# EAGLE schematic Torque_Coils (EAGLE 9.6.2)
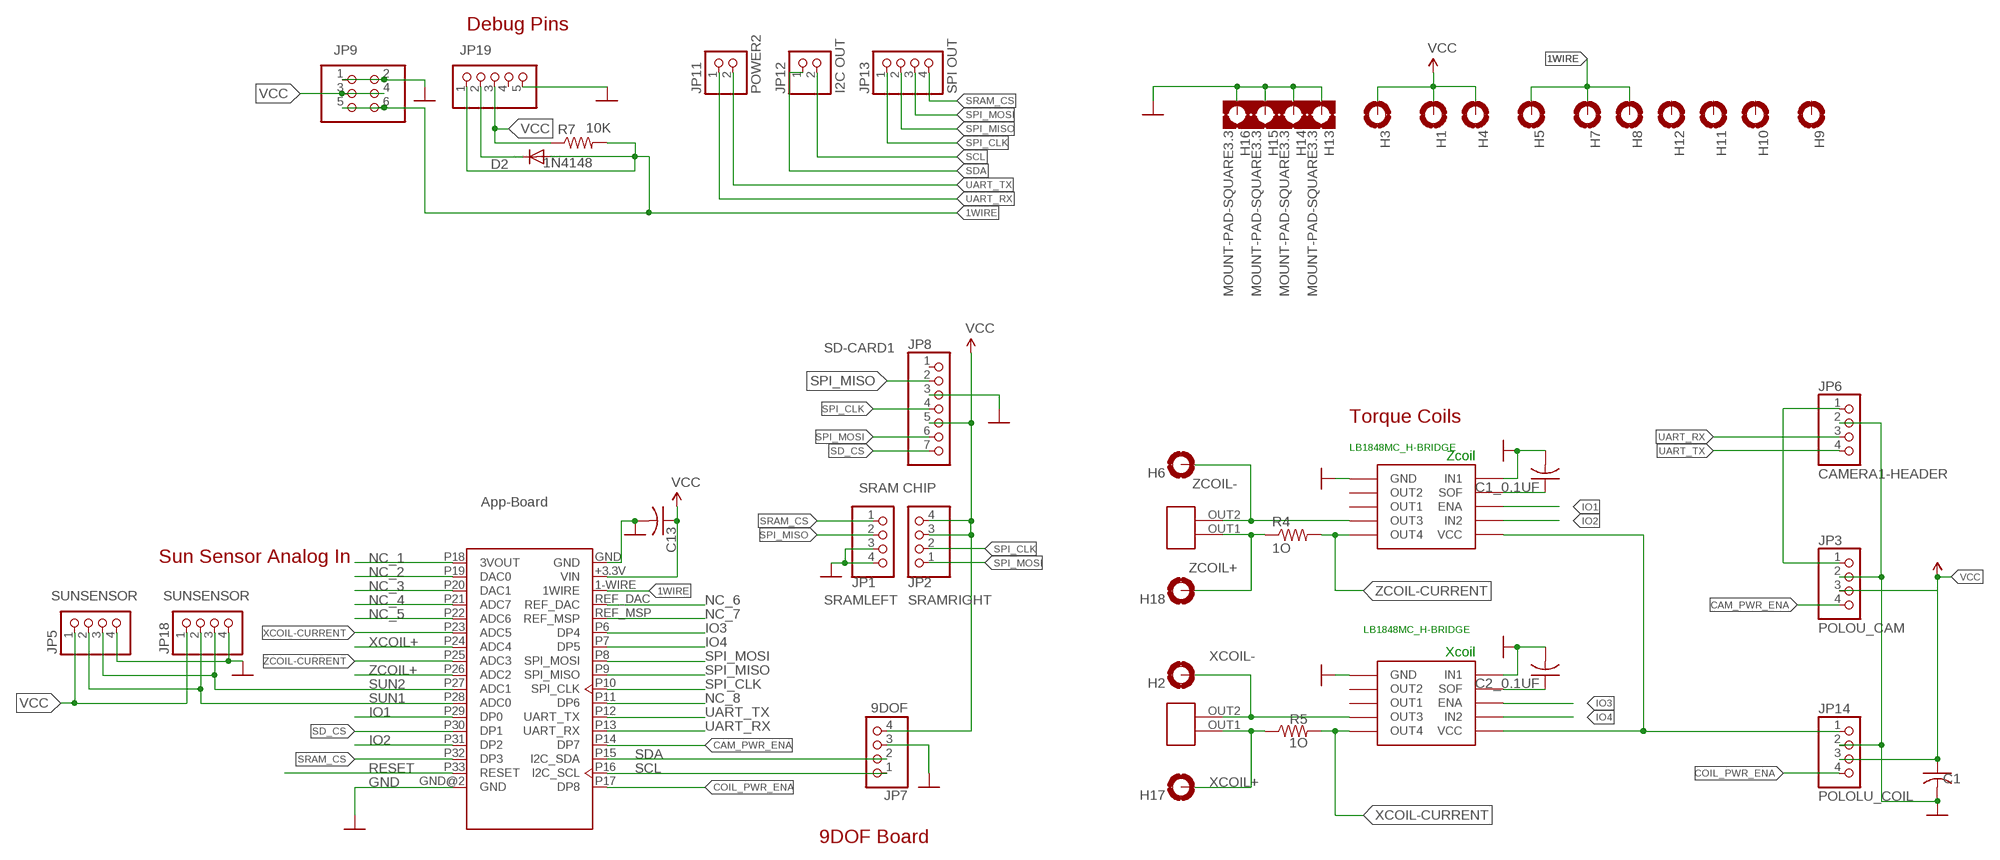
[diagram p0: schematic, sheet 1]

## Parts
C1  C-USC0805  [C0805]
C1_0.1UF  C-USC1206  [C1206]
C2_0.1UF  C-USC1206  [C1206]
C13  C-USC0805  [C0805]
D2  1N4148  1N4148DO35-7  [DO35-7]
H1  MOUNT-PAD-ROUND3.3  [3,3-PAD]
H2  MOUNT-PAD-ROUND3.3  [3,3-PAD]
H3  MOUNT-PAD-ROUND3.3  [3,3-PAD]
H4  MOUNT-PAD-ROUND3.3  [3,3-PAD]
H5  MOUNT-PAD-ROUND3.3  [3,3-PAD]
H6  MOUNT-PAD-ROUND3.3  [3,3-PAD]
H7  MOUNT-PAD-ROUND3.3  [3,3-PAD]
H8  MOUNT-PAD-ROUND3.3  [3,3-PAD]
H9  MOUNT-PAD-ROUND3.3  [3,3-PAD]
H10  MOUNT-PAD-ROUND3.3  [3,3-PAD]
H11  MOUNT-PAD-ROUND3.3  [3,3-PAD]
H12  MOUNT-PAD-ROUND3.3  [3,3-PAD]
H13  MOUNT-PAD-SQUARE3.3  [3,3-PAD-SQUARE]
H14  MOUNT-PAD-SQUARE3.3  [3,3-PAD-SQUARE]
H15  MOUNT-PAD-SQUARE3.3  [3,3-PAD-SQUARE]
H16  MOUNT-PAD-SQUARE3.3  [3,3-PAD-SQUARE]
H17  MOUNT-PAD-ROUND3.3  [3,3-PAD]
H18  MOUNT-PAD-ROUND3.3  [3,3-PAD]
IC1  LB1848MC_H-BRIDGE  [LB1848MC_H-BRIDGE]
IC2  LB1848MC  LB1848MC_H-BRIDGE  [LB1848MC_H-BRIDGE]
JP1  SRAMLEFT  PINHD-1X4  [1X04]
JP2  SRAMRIGHT  PINHD-1X4  [1X04]
JP3  POLOU_CAM  PINHD-1X4  [1X04]
JP5  SUNSENSOR  PINHD-1X4  [1X04]
JP6  CAMERA1-HEADER  PINHD-1X4  [1X04]
JP7  9DOF  PINHD-1X4  [1X04]
JP8  SD-CARD1  PINHD-1X7  [1X07]
JP9  PINHD-2X3  [2X03]
JP11  POWER2  PINHD-1X2  [1X02]
JP12  I2C OUT  PINHD-1X2  [1X02]
JP13  SPI OUT  PINHD-1X4  [1X04]
JP14  POLOLU_COIL  PINHD-1X4  [1X04]
JP18  SUNSENSOR  PINHD-1X4  [1X04]
JP19  PINHD-1X5  [1X05]
R4  1O  R-US_R1206  [R1206]
R5  1O  R-US_R1206  [R1206]
R7  10K  R-US_0204/7  [0204/7]
U$1  App-Board 1.2/1.3  APP_CORE  [APPCORE_RECEIVER]
U$5  COIL_PINOUT  [COIL_PINOUT]
U$6  COIL_PINOUT  [COIL_PINOUT]

## Nets
1WIRE: D2.A H5.B3,3(MOUNT) H7.B3,3(MOUNT) H8.B3,3(MOUNT) JP9.5 JP9.6 JP19.1 R7.2 U$1.1-WIRE(1WIRE)
CAM_PWR_ENA: JP3.4 U$1.P14(DP7)
COIL-POWER: IC1.VCC IC2.VCC JP14.1
COIL_PWR_ENA: JP14.4 U$1.P17(DP8)
GND: C1.2 C1_0.1UF.2 C2_0.1UF.2 C13.2 H13.B3,3(MOUNT) H14.B3,3(MOUNT) H15.B3,3(MOUNT) H16.B3,3(MOUNT) IC1.GND IC1.IN1 IC2.GND IC2.IN1 JP1.3 JP1.4 JP3.2 JP5.4 JP6.2 JP7.3 JP8.3 JP9.1 JP9.2 JP14.2 JP18.4 JP19.5 U$1.GND U$1.GND@2(GND)
IO1: IC1.ENA U$1.P29(DP0)
IO2: IC1.IN2 U$1.P31(DP2)
IO3: IC2.ENA U$1.P6(DP4)
IO4: IC2.IN2 U$1.P7(DP5)
N$11: D2.C JP19.2
N$13: C2_0.1UF.1 IC2.SOF
N$14: C1_0.1UF.1 IC1.SOF
NC_1: U$1.P18(3VOUT)
NC_2: U$1.P19(DAC0)
NC_3: U$1.P20(DAC1)
NC_4: U$1.P21(ADC7)
NC_5: U$1.P22(ADC6)
NC_6: U$1.REF_DAC
NC_7: U$1.REF_MSP
NC_8: U$1.P11(DP6)
POWER-CAMERA: JP3.1 JP6.1
RESET: U$1.P33(RESET)
SCL: JP7.1 JP12.2 U$1.P16(I2C_SCL)
SD_CS: JP8.7 U$1.P30(DP1)
SDA: JP7.2 JP12.1 U$1.P15(I2C_SDA)
SPI_CLK: JP2.2 JP8.4 JP13.1 U$1.P10(SPI_CLK)
SPI_MISO: JP1.2 JP8.2 JP13.2 U$1.P9(SPI_MISO)
SPI_MOSI: JP2.1 JP8.6 JP13.3 U$1.P8(SPI_MOSI)
SRAM_CS: JP1.1 JP13.4 U$1.P32(DP3)
SUN1: JP5.2 JP18.2 U$1.P28(ADC0)
SUN2: JP5.3 JP18.3 U$1.P27(ADC1)
UART_RX: JP6.3 JP11.1 U$1.P13(UART_RX)
UART_TX: JP6.4 JP11.2 U$1.P12(UART_TX)
VCC: C1.1 C13.1 H1.B3,3(MOUNT) H3.B3,3(MOUNT) H4.B3,3(MOUNT) JP2.3 JP2.4 JP3.3 JP5.1 JP7.4 JP8.5 JP9.3 JP9.4 JP14.3 JP18.1 JP19.3 R7.1 U$1.+3.3V(VIN)
XCOIL+: H17.B3,3(MOUNT) R5.1 U$1.P24(ADC4) U$6.OUT1
XCOIL-: H2.B3,3(MOUNT) IC2.OUT3 U$6.OUT2
XCOIL-CURRENT: IC2.OUT4 R5.2 U$1.P23(ADC5)
ZCOIL+: H18.B3,3(MOUNT) R4.1 U$1.P26(ADC2) U$5.OUT1
ZCOIL-: H6.B3,3(MOUNT) IC1.OUT3 U$5.OUT2
ZCOIL-CURRENT: IC1.OUT4 R4.2 U$1.P25(ADC3)
Unconnected: H9.B3,3(MOUNT) H10.B3,3(MOUNT) H11.B3,3(MOUNT) H12.B3,3(MOUNT) IC1.OUT1 IC1.OUT2 IC2.OUT1 IC2.OUT2 JP8.1 JP19.4

## Notes on the sheet
- Debug Pins
- Torque Coils
- LB1848MC_H-BRIDGE | Zcoil
- SRAM CHIP
- App-Board
- Sun Sensor Analog In
- LB1848MC_H-BRIDGE
- Xcoil
- 9DOF Board

## Library data of the parts
C1 C13 = resistor:C-US: CAPACITOR, American symbol
C1_0.1UF C2_0.1UF = rcl:C-US: CAPACITOR, American symbol
D2 = diode:1N4148: DIODE high speed (Philips)
H1-H12 H17 H18 = holes:MOUNT-PAD-ROUND: MOUNTING PAD, round
H13-H16 = holes:MOUNT-PAD-SQUARE: MOUNTING PAD, square
IC1 IC2 = 9DoF_board:LB1848MC_H-BRIDGE
JP1-JP3 JP5-JP7 JP13 JP14 JP18 = pinhead:PINHD-1X4: PIN HEADER
JP8 = pinhead:PINHD-1X7: PIN HEADER
JP9 = pinhead:PINHD-2X3: PIN HEADER
JP11 JP12 = pinhead:PINHD-1X2: PIN HEADER
JP19 = pinhead:PINHD-1X5: PIN HEADER
R4 R5 = resistor:R-US_: RESISTOR, American symbol
R7 = rcl:R-US_: RESISTOR, American symbol
U$1 = LearningByMaking2:APP_CORE
U$5 U$6 = 9DoF_board:COIL_PINOUT

## Module CAMERA
Ports: 

### Library data of the parts